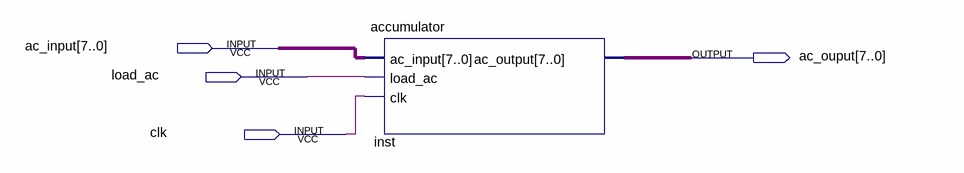
[diagram p0: schematic sheet]
// Quartus schematic ac_sim_tb.bdf as structural Verilog: 1 symbols, 4 pins
module ac_sim_tb (
  input  [7:0] ac_input,
  input  load_ac,
  input  clk,
  output [7:0] ac_ouput
);

  accumulator inst (.ac_input(ac_input), .load_ac(load_ac), .clk(clk), .ac_output(ac_ouput));
endmodule
